# EAGLE design untitled (EAGLE 9.6.2)

## Sheet 1 of 5
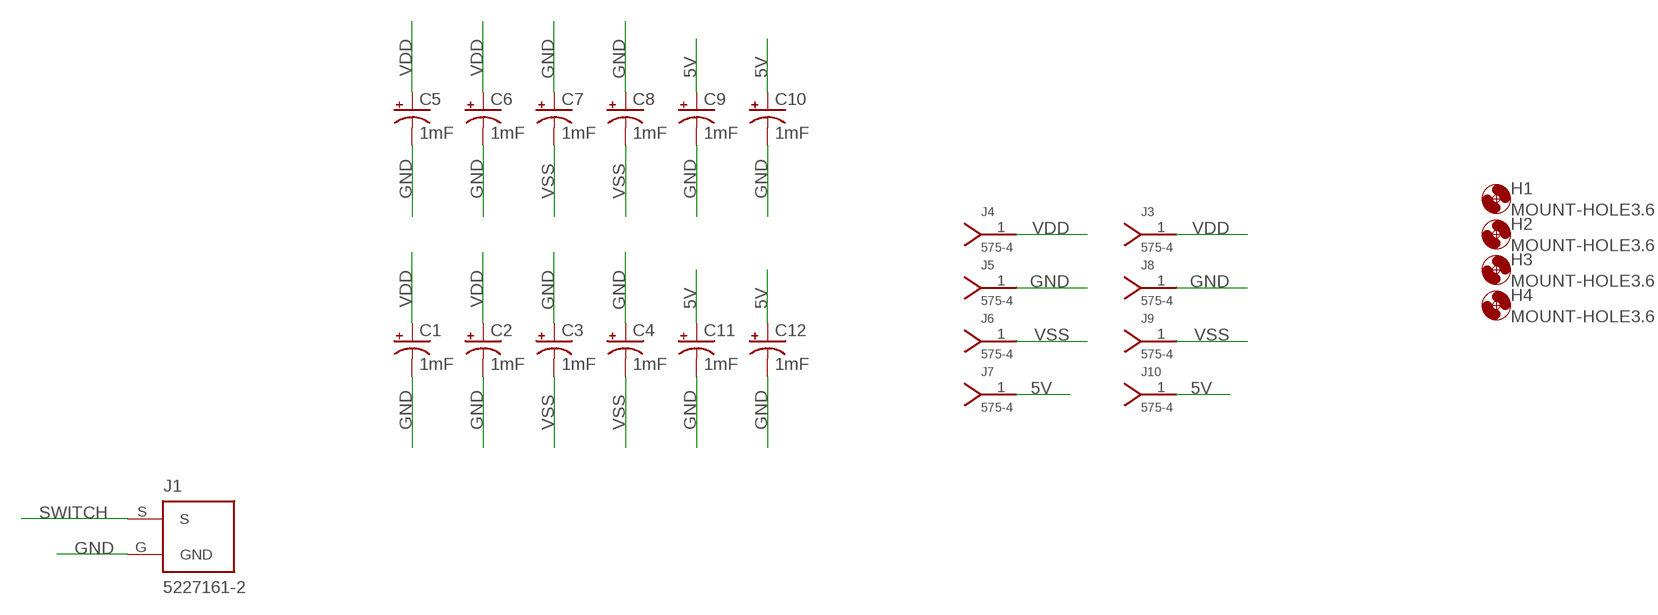
[diagram p0: schematic, sheet 1]

### Parts
C1  1mF  1000UF-RADIAL-5MM-25V-20%  [CPOL-RADIAL-5MM-10MM]
C2  1mF  1000UF-RADIAL-5MM-25V-20%  [CPOL-RADIAL-5MM-10MM]
C3  1mF  1000UF-RADIAL-5MM-25V-20%  [CPOL-RADIAL-5MM-10MM]
C4  1mF  1000UF-RADIAL-5MM-25V-20%  [CPOL-RADIAL-5MM-10MM]
C5  1mF  1000UF-RADIAL-5MM-25V-20%  [CPOL-RADIAL-5MM-10MM]
C6  1mF  1000UF-RADIAL-5MM-25V-20%  [CPOL-RADIAL-5MM-10MM]
C7  1mF  1000UF-RADIAL-5MM-25V-20%  [CPOL-RADIAL-5MM-10MM]
C8  1mF  1000UF-RADIAL-5MM-25V-20%  [CPOL-RADIAL-5MM-10MM]
C9  1mF  1000UF-RADIAL-5MM-25V-20%  [CPOL-RADIAL-5MM-10MM]
C10  1mF  1000UF-RADIAL-5MM-25V-20%  [CPOL-RADIAL-5MM-10MM]
C11  1mF  1000UF-RADIAL-5MM-25V-20%  [CPOL-RADIAL-5MM-10MM]
C12  1mF  1000UF-RADIAL-5MM-25V-20%  [CPOL-RADIAL-5MM-10MM]
H1  MOUNT-HOLE3.6  [3,6]
H2  MOUNT-HOLE3.6  [3,6]
H3  MOUNT-HOLE3.6  [3,6]
H4  MOUNT-HOLE3.6  [3,6]
J1  5227161-2  [TE_5227161-2]
J3  575-4  [KEYSTONE_575-4]
J4  575-4  [KEYSTONE_575-4]
J5  575-4  [KEYSTONE_575-4]
J6  575-4  [KEYSTONE_575-4]
J7  575-4  [KEYSTONE_575-4]
J8  575-4  [KEYSTONE_575-4]
J9  575-4  [KEYSTONE_575-4]
J10  575-4  [KEYSTONE_575-4]

### Nets
5V: C9.+ C10.+ C11.+ C12.+ J7.1 J10.1 ; also sheet 2,3,4,5
GND: C1.- C2.- C3.+ C4.+ C5.- C6.- C7.+ C8.+ C9.- C10.- C11.- C12.- J1.G(GND) J5.1 J8.1 ; also sheet 2,3,4,5
SWITCH: J1.S ; also sheet 2,3,4,5
VDD: C1.+ C2.+ C5.+ C6.+ J3.1 J4.1 ; also sheet 2,3,4,5
VSS: C3.- C4.- C7.- C8.- J6.1 J9.1 ; also sheet 2,3,4,5

## Sheet 2 of 5
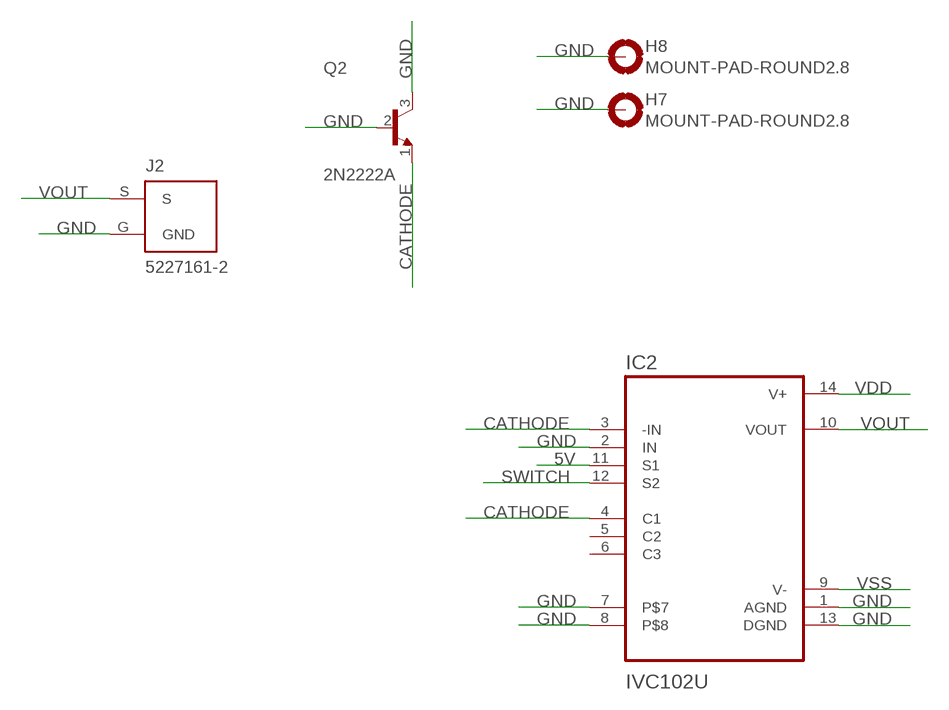
[diagram p1: schematic, sheet 2]

### Parts
H7  MOUNT-PAD-ROUND2.8  [2,8-PAD]
H8  MOUNT-PAD-ROUND2.8  [2,8-PAD]
IC2  IVC102U  [SOIC127P600X175-14N]
J2  5227161-2  [TE_5227161-2]
Q2  2N2222A  [TO127P584H533-3]

### Nets
5V: IC2.11(S1) ; also sheet 1,3,4,5
CATHODE: IC2.3(-IN) IC2.4(C1) Q2.1(E)
GND: H7.B2,8(MOUNT) H8.B2,8(MOUNT) IC2.1(AGND) IC2.2(IN) IC2.7 IC2.8 IC2.13(DGND) J2.G(GND) Q2.2(B) Q2.3(C) ; also sheet 1,3,4,5
SWITCH: IC2.12(S2) ; also sheet 1,3,4,5
VDD: IC2.14(V+) ; also sheet 1,3,4,5
VOUT: IC2.10(VOUT) J2.S
VSS: IC2.9(V-) ; also sheet 1,3,4,5
Unconnected: IC2.5(C2) IC2.6(C3)

## Sheet 3 of 5
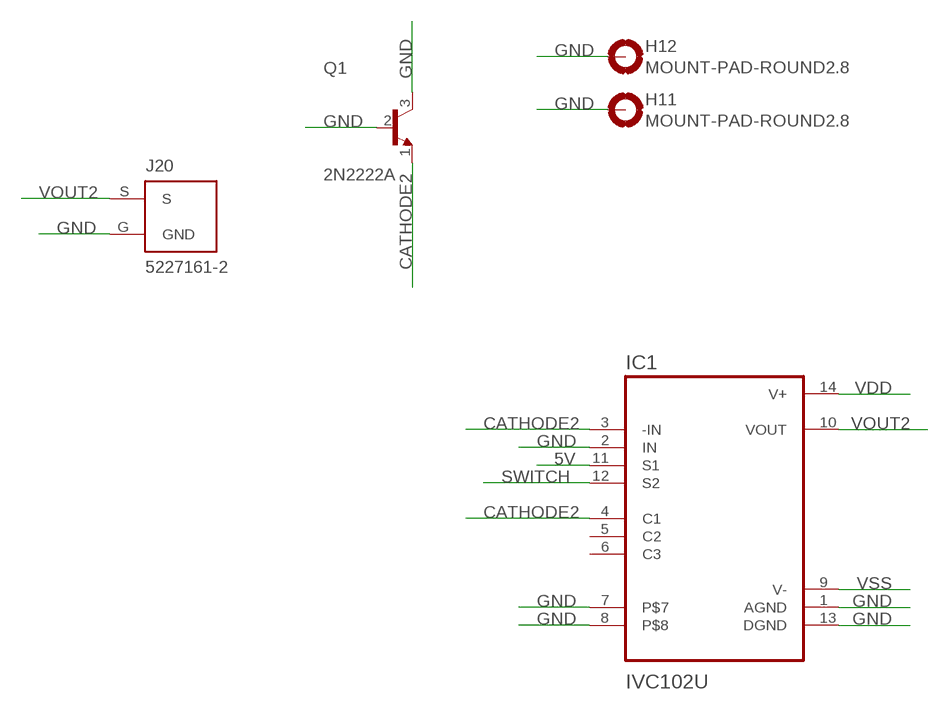
[diagram p2: schematic, sheet 3]

### Parts
H11  MOUNT-PAD-ROUND2.8  [2,8-PAD]
H12  MOUNT-PAD-ROUND2.8  [2,8-PAD]
IC1  IVC102U  [SOIC127P600X175-14N]
J20  5227161-2  [TE_5227161-2]
Q1  2N2222A  [TO127P584H533-3]

### Nets
5V: IC1.11(S1) ; also sheet 1,2,4,5
CATHODE2: IC1.3(-IN) IC1.4(C1) Q1.1(E)
GND: H11.B2,8(MOUNT) H12.B2,8(MOUNT) IC1.1(AGND) IC1.2(IN) IC1.7 IC1.8 IC1.13(DGND) J20.G(GND) Q1.2(B) Q1.3(C) ; also sheet 1,2,4,5
SWITCH: IC1.12(S2) ; also sheet 1,2,4,5
VDD: IC1.14(V+) ; also sheet 1,2,4,5
VOUT2: IC1.10(VOUT) J20.S
VSS: IC1.9(V-) ; also sheet 1,2,4,5
Unconnected: IC1.5(C2) IC1.6(C3)

## Sheet 4 of 5
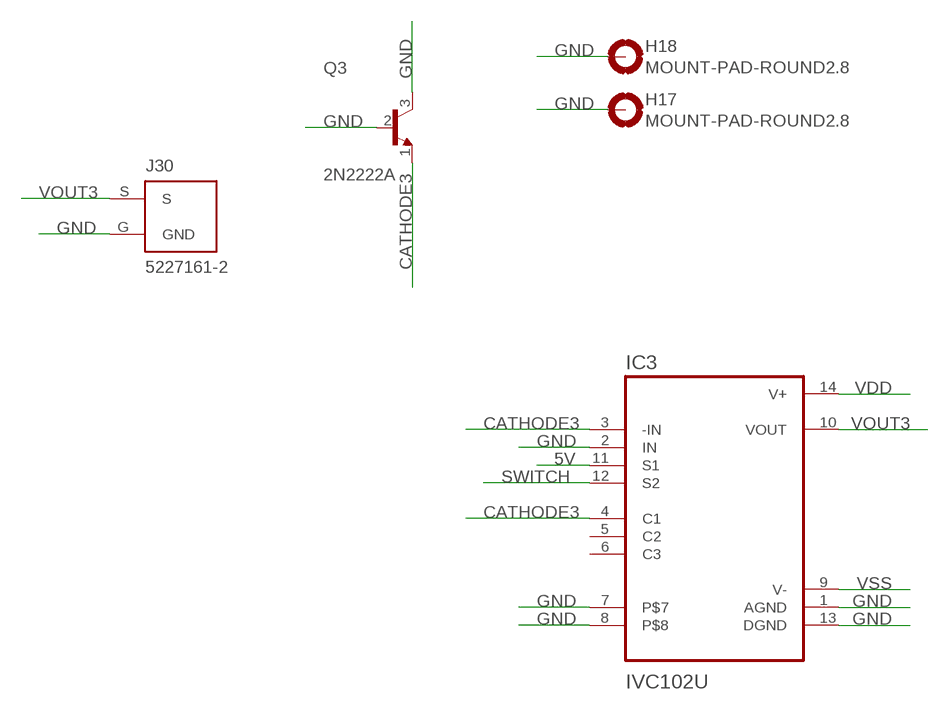
[diagram p3: schematic, sheet 4]

### Parts
H17  MOUNT-PAD-ROUND2.8  [2,8-PAD]
H18  MOUNT-PAD-ROUND2.8  [2,8-PAD]
IC3  IVC102U  [SOIC127P600X175-14N]
J30  5227161-2  [TE_5227161-2]
Q3  2N2222A  [TO127P584H533-3]

### Nets
5V: IC3.11(S1) ; also sheet 1,2,3,5
CATHODE3: IC3.3(-IN) IC3.4(C1) Q3.1(E)
GND: H17.B2,8(MOUNT) H18.B2,8(MOUNT) IC3.1(AGND) IC3.2(IN) IC3.7 IC3.8 IC3.13(DGND) J30.G(GND) Q3.2(B) Q3.3(C) ; also sheet 1,2,3,5
SWITCH: IC3.12(S2) ; also sheet 1,2,3,5
VDD: IC3.14(V+) ; also sheet 1,2,3,5
VOUT3: IC3.10(VOUT) J30.S
VSS: IC3.9(V-) ; also sheet 1,2,3,5
Unconnected: IC3.5(C2) IC3.6(C3)

## Sheet 5 of 5
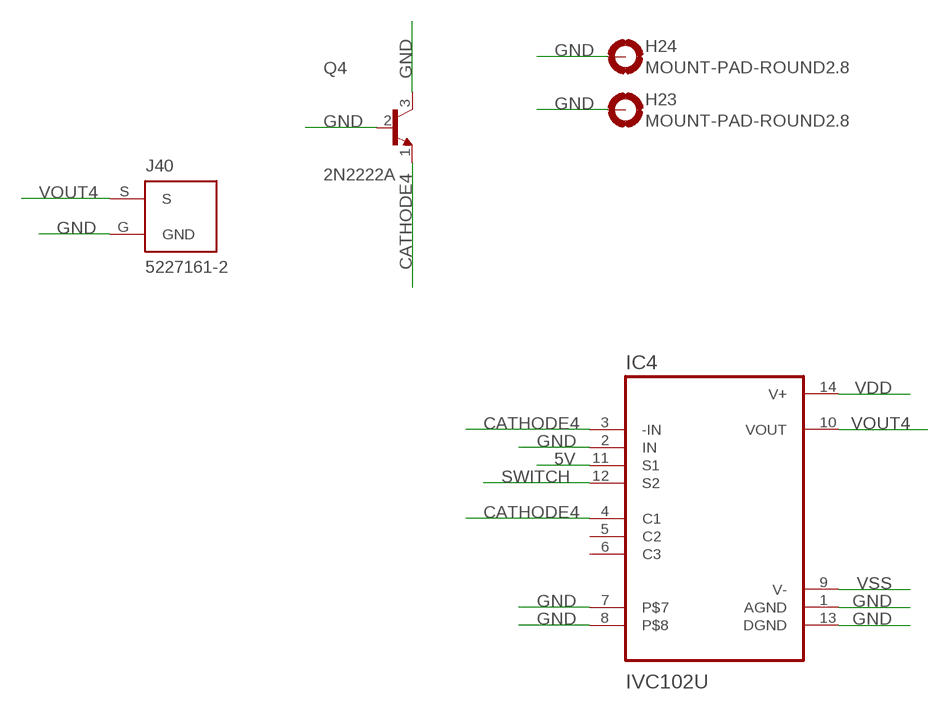
[diagram p4: schematic, sheet 5]

### Parts
H23  MOUNT-PAD-ROUND2.8  [2,8-PAD]
H24  MOUNT-PAD-ROUND2.8  [2,8-PAD]
IC4  IVC102U  [SOIC127P600X175-14N]
J40  5227161-2  [TE_5227161-2]
Q4  2N2222A  [TO127P584H533-3]

### Nets
5V: IC4.11(S1) ; also sheet 1,2,3,4
CATHODE4: IC4.3(-IN) IC4.4(C1) Q4.1(E)
GND: H23.B2,8(MOUNT) H24.B2,8(MOUNT) IC4.1(AGND) IC4.2(IN) IC4.7 IC4.8 IC4.13(DGND) J40.G(GND) Q4.2(B) Q4.3(C) ; also sheet 1,2,3,4
SWITCH: IC4.12(S2) ; also sheet 1,2,3,4
VDD: IC4.14(V+) ; also sheet 1,2,3,4
VOUT4: IC4.10(VOUT) J40.S
VSS: IC4.9(V-) ; also sheet 1,2,3,4
Unconnected: IC4.5(C2) IC4.6(C3)

## Library data of the parts
C1-C12 = SparkFun-Capacitors:1000UF: 1,000µF/1mF ceramic capacitors A capacitor is a passive two-terminal electrical component used to store electrical energy temporarily in an electric field. CAP-08070; PROD_ID: CAP-09538
H1-H4 = holes:MOUNT-HOLE: MOUNTING HOLE with drill center marker
H7 H8 H11 H12 H17 H18 H23 H24 = holes:MOUNT-PAD-ROUND: MOUNTING PAD, round
IC1-IC4 = IVC102U:IVC102U: Check prices <https://pricing.snapeda.com/parts/IVC102U/Texas/view-part?ref=eda>; AVAILABILITY: Good; DESCRIPTION: Precision Switched Integrator Transimpedance Amplifier 14-SOIC -40 to 125; MF: Texas; MP: IVC102U; PACKAGE: SO-14 Burr Brown; PRICE: None; PURCHASE-URL: https://pricing.snapeda.com/search/part/IVC102U/?ref=eda
J1 J2 J20 J30 J40 = 5227161-2:5227161-2: Jack, PCB; 50 Ohms; Right Angle; BNC; Gold (30); Panel; Jack; Valox; Phosphor Bronze; COMMENT: 5227161-2; DESCRIPTION: Valox Black 50 Ohm Right Angle Jack PCB Mount BNC Connector; DIGI-KEY_PART_NUMBER: A32245-ND; EU_ROHS_COMPLIANCE: Compliant with Exemptions; MF: TE Connectivity; MP: 5227161-2; NUMBER_OF_POSITIONS: 1; PACKAGE: SMD-6 Omron Electronics; PURCHASE-URL: https://pricing.snapeda.com/search/part/5227161-2/?ref=eda
J3-J10 = 575-4:575-4: Battery Holders, Contacts and Clips JACK; DESCRIPTION: Banana Jack- Non-Insulated .218 Length; DIGI-KEY_PART_NUMBER: 36-575-4-ND; MF: Keystone Electronics; MP: 575-4; PACKAGE: None; PURCHASE-URL: https://pricing.snapeda.com/search/part/575-4/?ref=eda
Q1-Q4 = 2N2222A:2N2222A: 2N2222A 50 V 800 mA NPN Silicon Switching Transistor - TO-18 (TO-206AA) Check prices <https://pricing.snapeda.com/parts/2N2222A/ON%20Semiconductor/view-part?ref=eda>; AVAILABILITY: Good; DESCRIPTION: Bipolar (BJT) Transistor NPN 50V 800mA 500mW Through Hole TO-18; MF: ON Semiconductor; MP: 2N2222A; PACKAGE: TO-18 Microsemi; PRICE: None; PURCHASE-URL: https://pricing.snapeda.com/search/part/2N2222A/?ref=eda

## Board
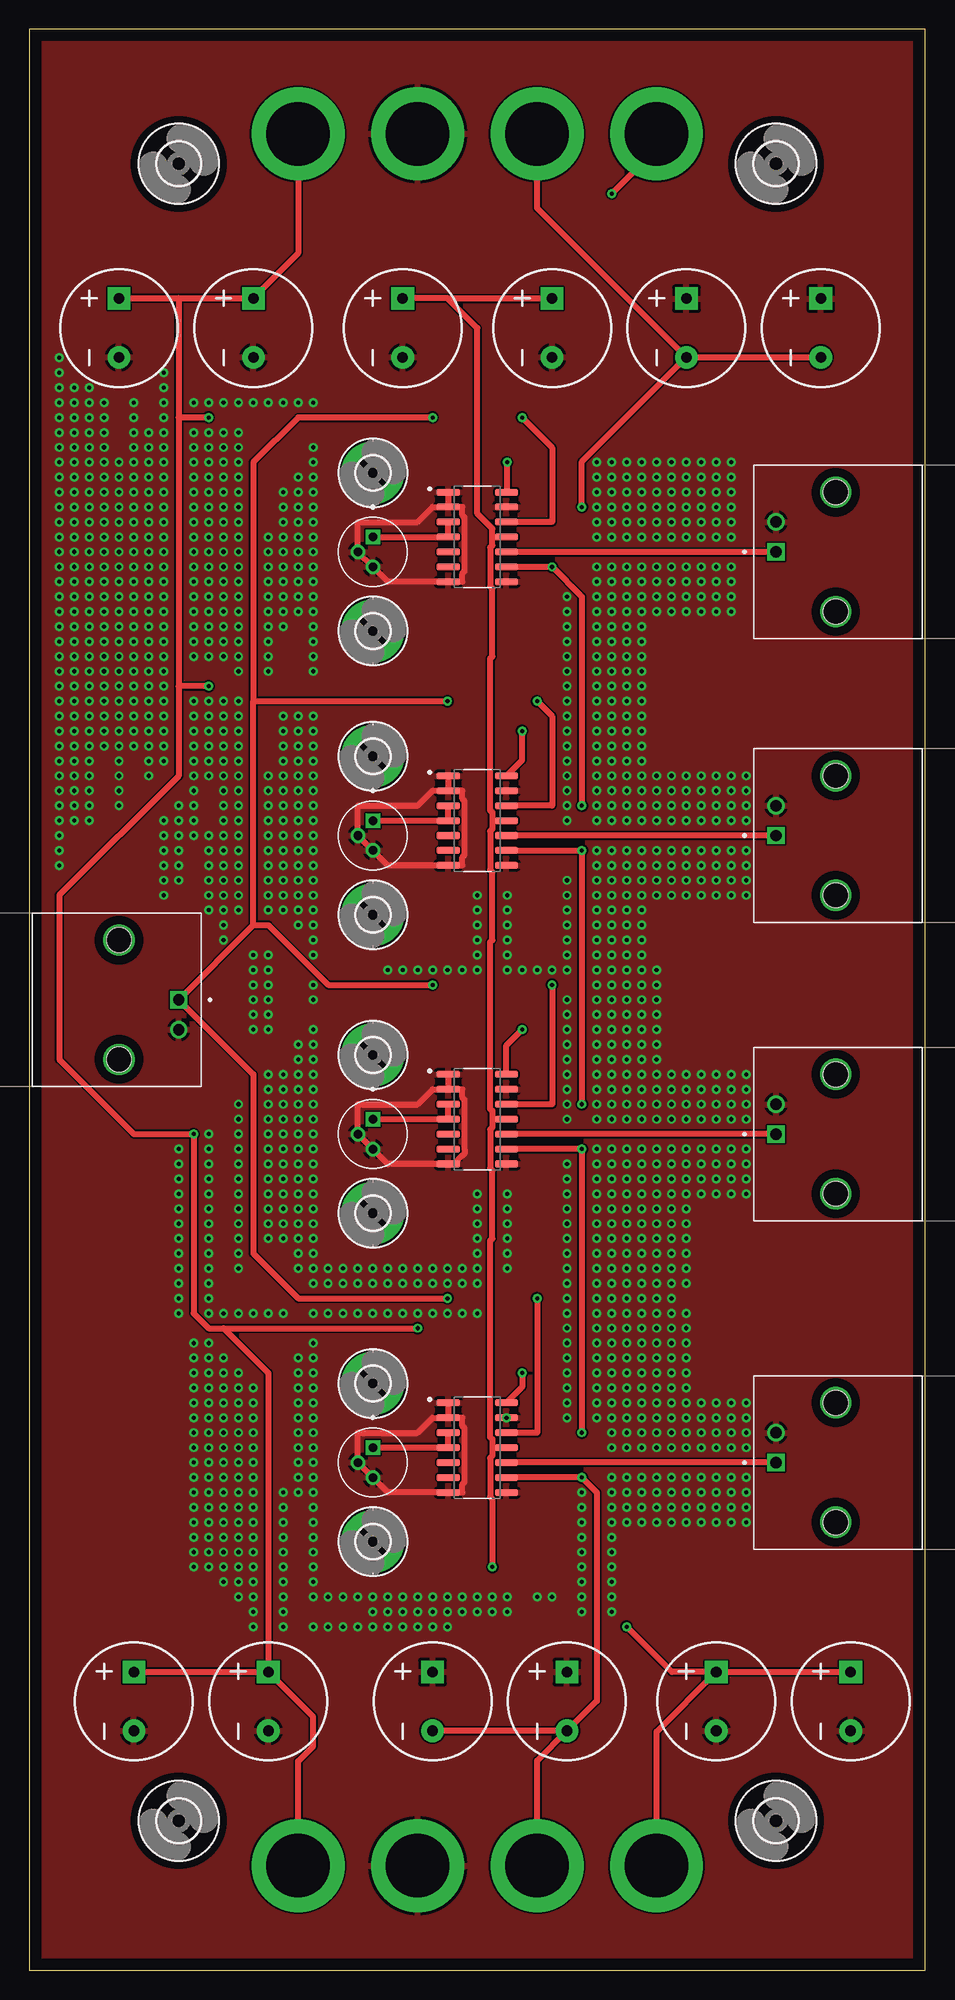
[diagram p5: board, top side]
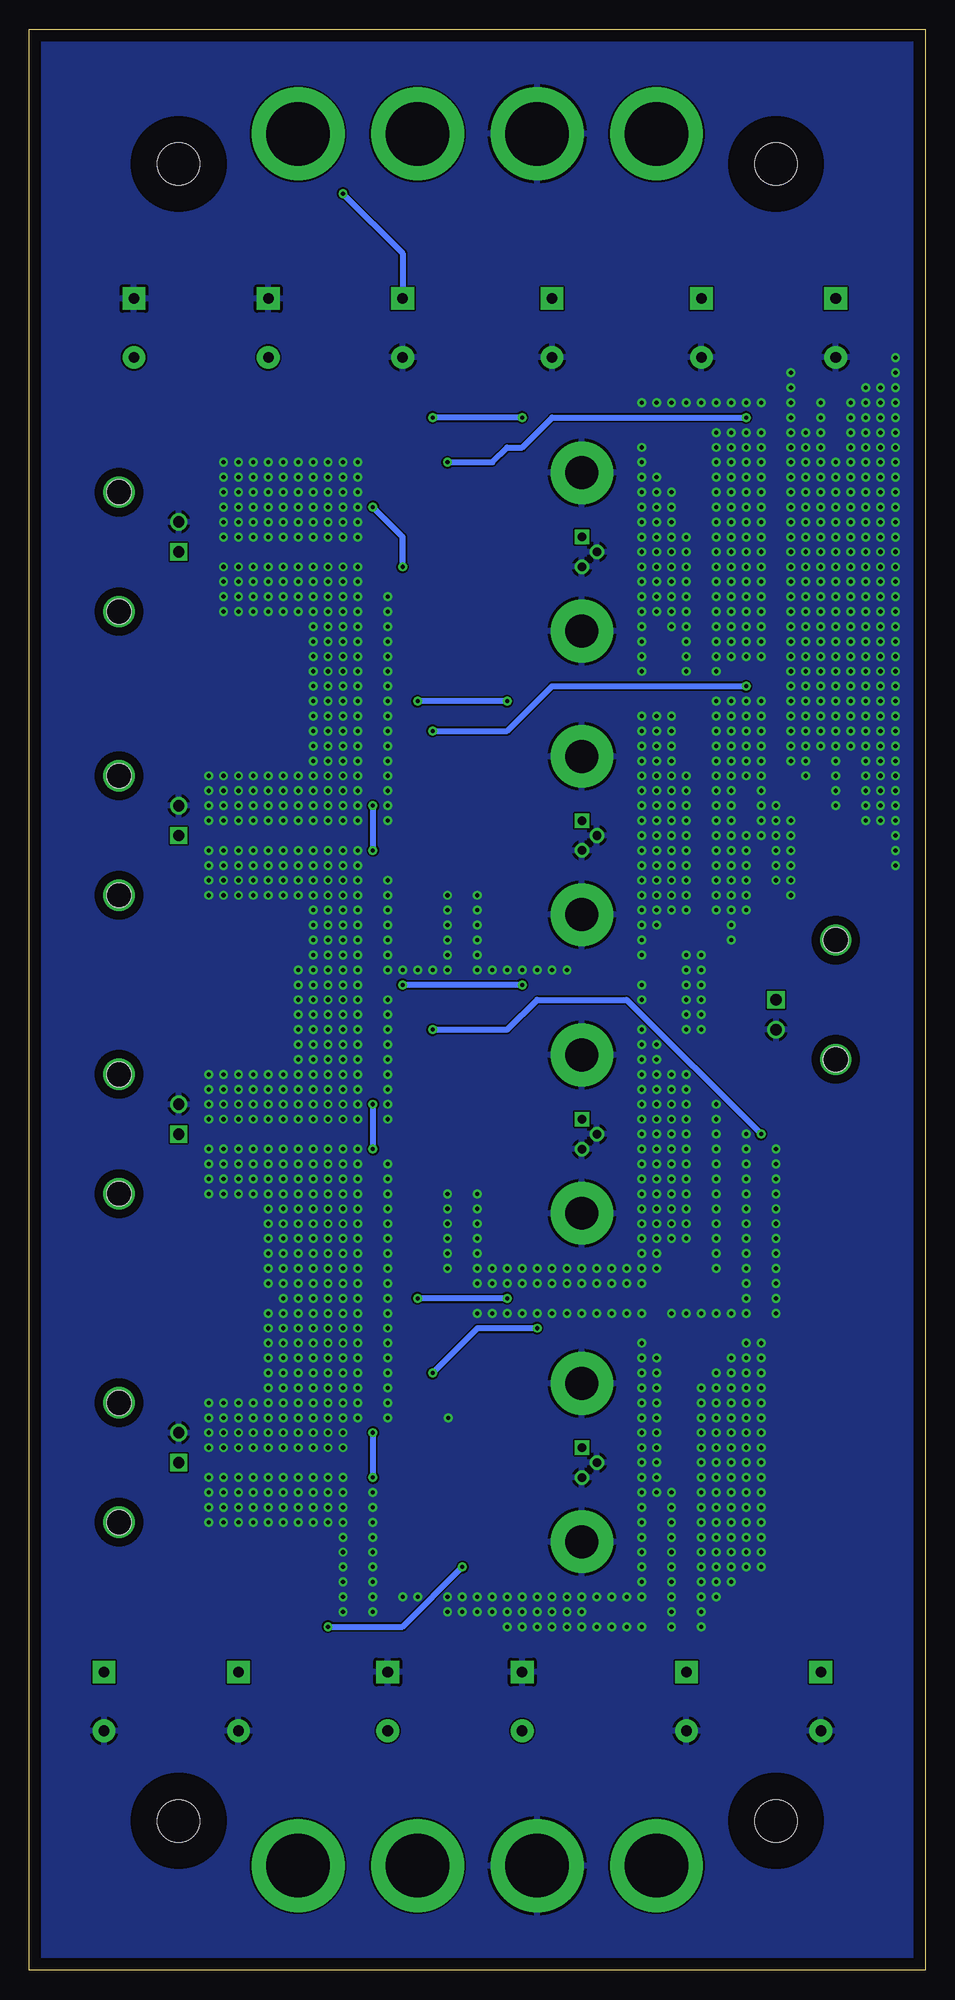
[diagram p6: board, bottom side, seen from below]

Size 76.2 x 165.1 mm. Coordinates in mm from the lower left corner, seen from the top.
Outline: 0,0 76.2,0 76.2,165.1 0,165.1 0,0
Copper layers (1*16): Top 0.035mm / dielectric 1.5mm / Bottom 0.035mm
Design rules "default": minimum track width 6mil, minimum drill 0.35mm, track to track 6mil, track to pad 6mil, pad to pad 6mil, via to via 6mil, smd to smd 6mil, copper to edge 40mil, drill to drill 6mil, minimum pad ring 10mil, minimum via ring 8mil, stop-mask expansion 4mil, vias tented up to drill 0mil, thermal gap 10mil

### Footprints (pad centres in the part's own frame; a part is rotated, then mirrored left to right if it is on the bottom)
CPOL-RADIAL-5MM-10MM = drill 0.9 pad 1.93 square: + 2.5,0 | drill 0.9 pad 1.93: - -2.5,0
3,6 = hole 3.6: 0,0
2,8-PAD = drill 2.8 pad 5.334: B2,8 0,0
SOIC127P600X175-14N = smd 1.97 x 0.6: 1 -2.475,3.81; 2 -2.475,2.54; 3 -2.475,1.27; 4 -2.475,0; 5 -2.475,-1.27; 6 -2.475,-2.54; 7 -2.475,-3.81; 8 2.475,-3.81; 9 2.475,-2.54; 10 2.475,-1.27; 11 2.475,0; 12 2.475,1.27; 13 2.475,2.54; 14 2.475,3.81
TE_5227161-2 = drill 0.97: G -2.54,-5.08 | drill 0.97 square: S 0,-5.08 | hole 2.09: 5.08,0; -5.08,0
KEYSTONE_575-4 = drill 5.4 pad 7.9: 1 0,0
TO127P584H533-3 = drill 0.73 pad 1.13 square: 1 -1.27,0 | drill 0.73 pad 1.13: 2 0,-1.27; 3 1.27,0

### Placement (x,y rotation side)
C1  8.89,22.86 90 top
C2  20.32,22.86 90 top
C3  34.29,22.86 90 top
C4  45.72,22.86 90 top
C5  7.62,139.7 90 top
C6  19.05,139.7 90 top
C7  67.31,139.7 90 top
C8  55.88,139.7 90 top
C9  31.75,139.7 90 top
C10  44.45,139.7 90 top
C11  58.42,22.86 90 top
C12  69.85,22.86 90 top
H1  63.5,153.67 0 top
H2  12.7,153.67 0 top
H3  63.5,12.7 0 top
H4  12.7,12.7 0 top
H7  29.21,127.38 0 top
H8  29.21,113.92 0 top
H11  29.21,103.25 0 top
H12  29.21,89.79 0 top
H17  29.21,77.85 0 top
H18  29.21,64.39 0 top
H23  29.21,49.91 0 top
H24  29.21,36.45 0 top
IC1  38.1,97.79 0 top
IC2  38.1,121.92 0 top
IC3  38.1,72.39 0 top
IC4  38.1,44.45 0 top
J1  7.62,82.55 90 top
J2  68.58,120.65 270 top
J3  22.86,8.89 0 top
J4  22.86,156.21 180 top
J5  33.02,156.21 180 top
J6  43.18,156.21 180 top
J7  53.34,156.21 180 top
J8  33.02,8.89 0 top
J9  43.18,8.89 0 top
J10  53.34,8.89 0 top
J20  68.58,96.52 270 top
J30  68.58,71.12 270 top
J40  68.58,43.18 270 top
Q1  29.21,96.52 270 top
Q2  29.21,120.65 270 top
Q3  29.21,71.12 270 top
Q4  29.21,43.18 270 top

### Tracks (layer width: path | path; a pad name or v marks a point on that pad's centre or on a via)
5V  (via drill 0.35)
  Top 0.508: 39.37,121.92 39.37,121.22 39.18,121.03 39.18,117.73 39.37,117.54 39.37,111.76 39.18,111.57 39.18,98.68 39.37,98.49 39.37,97.79 | 39.37,121.92 39.37,122.62 38.1,123.89 38.1,139.7 35.6,142.2 | 39.37,97.79 39.37,97.09 39.18,96.9 39.18,93.6 39.37,93.41 39.37,87.63 39.18,87.44 39.18,73.28 39.37,73.09 39.37,72.39 | 39.37,72.39 39.37,71.69 39.18,71.5 39.18,68.2 39.37,68.01 39.37,62.23 39.18,62.04 39.18,45.34 39.37,45.15 39.37,44.45 | v39.37,34.29 39.37,40.07 39.18,40.26 39.18,43.56 39.37,43.75 39.37,44.45 | J7.1 53.34,154.94 v49.53,151.13 | C10.+ 35.6,142.2 | 35.6,142.2 35.56,142.24 31.79,142.24 C9.+ | J10.1 53.34,20.28 C11.+ | C11.+ C12.+ | C11.+ 54.65,25.36 v50.8,29.21 | 39.37,97.79 IC1.11 | 39.37,121.92 IC2.11 | 39.37,72.39 IC3.11 | 39.37,44.45 IC4.11
  Bottom 0.508: v49.53,151.13 44.45,146.05 C10.+ | v50.8,29.21 44.45,29.21 v39.37,34.29
CATHODE
  Top 0.508: Q2.1 IC2.4 IC2.3
CATHODE2
  Top 0.508: Q1.1 IC1.4 IC1.3
CATHODE3
  Top 0.508: Q3.1 IC3.4 IC3.3
CATHODE4
  Top 0.508: Q4.1 IC4.4 IC4.3
GND  (via drill 0.35)
  Top 0.508: IC2.2 34.29,124.46 33.02,123.19 27.94,123.19 Q2.2 Q2.3 30.48,118.11 IC2.7 36.83,118.11 36.83,118.81 37.02,119 37.02,123.57 36.83,123.76 36.83,124.46 IC2.2 | IC2.1 IC2.2 | IC1.2 34.29,100.33 33.02,99.06 27.94,99.06 Q1.2 Q1.3 30.48,93.98 IC1.7 36.83,93.98 36.83,94.68 37.02,94.87 37.02,99.44 36.83,99.63 36.83,100.33 IC1.2 | IC1.1 IC1.2 | IC3.2 34.29,74.93 33.02,73.66 27.94,73.66 Q3.2 Q3.3 30.48,68.58 35.56,68.58 IC3.7 36.13,68.58 36.83,69.28 37.02,69.47 37.02,69.85 37.02,74.04 36.83,74.23 36.83,74.93 IC3.2 | IC3.1 IC3.2 | IC4.2 34.29,46.99 33.02,45.72 27.94,45.72 Q4.2 Q4.3 30.48,40.64 IC4.7 36.83,40.64 36.83,41.34 37.02,41.53 37.02,46.1 36.83,46.29 36.83,46.99 IC4.2 | IC4.1 IC4.2
  other vias: 40.58,46.99 24.13,31.75 25.4,31.75 24.13,33.02 24.13,34.29 24.13,35.56 24.13,36.83 24.13,38.1 24.13,39.37 24.13,40.64 24.13,41.91 24.13,43.18 24.13,44.45 24.13,45.72 24.13,46.99 24.13,48.26 24.13,49.53 24.13,50.8 24.13,52.07 24.13,53.34 24.13,55.88 24.13,58.42 24.13,59.69 24.13,60.96 24.13,62.23 24.13,63.5 24.13,64.77 24.13,66.04 24.13,67.31 24.13,68.58 24.13,69.85 24.13,71.12 24.13,72.39 24.13,73.66 24.13,74.93 24.13,76.2 24.13,77.47 24.13,78.74 24.13,80.01 24.13,82.55 24.13,83.82 24.13,86.36 24.13,87.63 24.13,88.9 24.13,90.17 24.13,91.44 24.13,92.71 24.13,93.98 24.13,95.25 24.13,96.52 24.13,97.79 24.13,99.06 24.13,100.33 24.13,101.6 24.13,102.87 24.13,104.14 24.13,105.41 24.13,106.68 24.13,110.49 24.13,111.76 24.13,113.03 24.13,114.3 24.13,115.57 24.13,116.84 24.13,118.11 24.13,119.38 24.13,120.65 24.13,121.92 24.13,123.19 24.13,124.46 24.13,125.73 24.13,127 24.13,128.27 24.13,129.54 26.67,31.75 27.94,31.75 29.21,31.75 30.48,31.75 31.75,31.75 33.02,31.75 34.29,31.75 35.56,31.75 36.83,31.75 38.1,31.75 39.37,31.75 40.64,31.75 43.18,31.75 44.45,31.75 48.26,119.38 49.53,119.38 50.8,119.38 52.07,119.38 53.34,119.38 54.61,119.38 55.88,119.38 57.15,119.38 58.42,119.38 59.69,119.38 48.26,121.92 49.53,121.92 50.8,121.92 52.07,121.92 53.34,121.92 54.61,121.92 55.88,121.92 57.15,121.92 58.42,121.92 59.69,121.92 15.24,111.76 15.24,113.03 15.24,114.3 15.24,115.57 15.24,116.84 15.24,118.11 16.51,111.76 16.51,113.03 16.51,114.3 16.51,115.57 16.51,116.84 16.51,118.11 17.78,110.49 17.78,111.76 17.78,113.03 17.78,114.3 17.78,115.57 17.78,116.84 17.78,118.11 17.78,119.38 17.78,120.65 17.78,121.92 15.24,119.38 15.24,120.65 15.24,121.92 15.24,123.19 15.24,124.46 15.24,125.73 15.24,127 15.24,128.27 15.24,129.54 15.24,130.81 16.51,119.38 16.51,120.65 16.51,121.92 16.51,123.19 16.51,124.46 16.51,125.73 16.51,127 16.51,128.27 16.51,129.54 16.51,130.81 17.78,130.81 17.78,129.54 17.78,128.27 17.78,127 17.78,125.73 17.78,124.46 17.78,123.19 20.32,110.49 20.32,111.76 20.32,113.03 20.32,114.3 20.32,115.57 20.32,116.84 20.32,118.11 20.32,119.38 20.32,120.65 20.32,121.92 21.59,114.3 21.59,115.57 21.59,116.84 21.59,118.11 21.59,119.38 21.59,120.65 21.59,121.92 21.59,123.19 21.59,124.46 21.59,125.73 22.86,115.57 22.86,116.84 22.86,118.11 22.86,119.38 22.86,120.65 22.86,121.92 22.86,123.19 22.86,124.46 22.86,125.73 22.86,127 13.97,111.76 13.97,113.03 13.97,114.3 13.97,115.57 13.97,116.84 13.97,118.11 11.43,102.87 11.43,104.14 11.43,105.41 11.43,106.68 11.43,107.95 11.43,109.22 11.43,110.49 11.43,111.76 11.43,113.03 11.43,114.3 10.16,109.22 10.16,110.49 10.16,111.76 10.16,113.03 10.16,114.3 10.16,115.57 10.16,101.6 10.16,102.87 10.16,104.14 10.16,105.41 10.16,106.68 10.16,107.95 8.89,104.14 8.89,105.41 8.89,106.68 8.89,107.95 8.89,109.22 8.89,110.49 7.62,106.68 7.62,107.95 7.62,109.22 7.62,110.49 7.62,111.76 7.62,113.03 8.89,111.76 8.89,113.03 8.89,114.3 8.89,115.57 8.89,116.84 8.89,118.11 7.62,114.3 7.62,115.57 7.62,116.84 7.62,118.11 7.62,119.38 7.62,120.65 11.43,115.57 11.43,116.84 11.43,118.11 11.43,119.38 11.43,120.65 11.43,121.92 11.43,123.19 11.43,124.46 11.43,125.73 11.43,127 13.97,119.38 13.97,120.65 13.97,121.92 13.97,123.19 13.97,124.46 13.97,125.73 13.97,127 13.97,128.27 13.97,129.54 13.97,130.81 10.16,116.84 10.16,118.11 10.16,119.38 10.16,120.65 10.16,121.92 10.16,123.19 11.43,128.27 11.43,129.54 11.43,130.81 11.43,132.08 11.43,133.35 11.43,134.62 11.43,135.89 10.16,124.46 10.16,125.73 10.16,127 10.16,128.27 10.16,129.54 10.16,130.81 8.89,119.38 8.89,120.65 8.89,121.92 8.89,123.19 8.89,124.46 8.89,125.73 8.89,127 8.89,128.27 8.89,129.54 8.89,130.81 8.89,132.08 8.89,133.35 7.62,121.92 7.62,123.19 7.62,124.46 7.62,125.73 7.62,127 7.62,128.27 6.35,119.38 6.35,120.65 6.35,121.92 6.35,123.19 6.35,124.46 6.35,125.73 6.35,127 6.35,128.27 6.35,129.54 6.35,130.81 6.35,132.08 6.35,133.35 5.08,120.65 5.08,121.92 5.08,123.19 5.08,124.46 5.08,125.73 5.08,127 5.08,128.27 5.08,129.54 5.08,130.81 5.08,132.08 5.08,133.35 5.08,134.62 3.81,128.27 3.81,129.54 3.81,130.81 3.81,132.08 3.81,133.35 3.81,134.62 2.54,124.46 2.54,125.73 2.54,127 2.54,128.27 2.54,129.54 2.54,130.81 2.54,132.08 2.54,133.35 2.54,134.62 2.54,135.89 2.54,137.16 3.81,120.65 3.81,121.92 3.81,123.19 3.81,124.46 3.81,125.73 3.81,127 5.08,113.03 5.08,114.3 5.08,115.57 5.08,116.84 5.08,118.11 5.08,119.38 5.08,105.41 5.08,106.68 5.08,107.95 5.08,109.22 5.08,110.49 5.08,111.76 6.35,111.76 6.35,113.03 6.35,114.3 6.35,115.57 6.35,116.84 6.35,118.11 6.35,104.14 6.35,105.41 6.35,106.68 6.35,107.95 6.35,109.22 6.35,110.49 2.54,116.84 2.54,118.11 2.54,119.38 2.54,120.65 2.54,121.92 2.54,123.19 3.81,113.03 3.81,114.3 3.81,115.57 3.81,116.84 3.81,118.11 3.81,119.38 2.54,109.22 2.54,110.49 2.54,111.76 2.54,113.03 2.54,114.3 2.54,115.57 3.81,105.41 3.81,106.68 3.81,107.95 3.81,109.22 3.81,110.49 3.81,111.76 2.54,101.6 2.54,102.87 2.54,104.14 2.54,105.41 2.54,106.68 2.54,107.95 2.54,93.98 2.54,95.25 2.54,96.52 2.54,97.79 2.54,99.06 2.54,100.33 3.81,97.79 3.81,99.06 3.81,100.33 3.81,101.6 3.81,102.87 3.81,104.14 5.08,97.79 5.08,99.06 5.08,100.33 5.08,101.6 5.08,102.87 5.08,104.14 7.62,99.06 7.62,100.33 7.62,101.6 7.62,102.87 7.62,104.14 7.62,105.41 11.43,91.44 11.43,92.71 11.43,93.98 11.43,95.25 11.43,96.52 11.43,97.79 12.7,92.71 12.7,93.98 12.7,95.25 12.7,96.52 12.7,97.79 12.7,99.06 13.97,96.52 13.97,97.79 13.97,99.06 13.97,100.33 13.97,101.6 13.97,102.87 13.97,104.14 13.97,105.41 13.97,106.68 13.97,107.95 15.24,101.6 15.24,102.87 15.24,104.14 15.24,105.41 15.24,106.68 15.24,107.95 16.51,102.87 16.51,104.14 16.51,105.41 16.51,106.68 16.51,107.95 17.78,102.87 17.78,104.14 17.78,105.41 17.78,106.68 17.78,107.95 16.51,95.25 16.51,96.52 16.51,97.79 16.51,99.06 16.51,100.33 16.51,101.6 15.24,90.17 15.24,91.44 15.24,92.71 15.24,93.98 15.24,95.25 15.24,96.52 16.51,87.63 16.51,88.9 16.51,90.17 16.51,91.44 16.51,92.71 16.51,93.98 17.78,90.17 17.78,91.44 17.78,92.71 17.78,93.98 17.78,95.25 17.78,96.52 17.78,97.79 17.78,99.06 17.78,100.33 17.78,101.6 20.32,90.17 20.32,91.44 20.32,92.71 20.32,93.98 20.32,95.25 20.32,96.52 20.32,97.79 20.32,99.06 20.32,100.33 20.32,101.6 21.59,95.25 21.59,96.52 21.59,97.79 21.59,99.06 21.59,100.33 21.59,101.6 21.59,102.87 21.59,104.14 21.59,105.41 21.59,106.68 21.59,90.17 21.59,91.44 21.59,92.71 21.59,93.98 22.86,95.25 22.86,96.52 22.86,97.79 22.86,99.06 22.86,100.33 22.86,101.6 22.86,102.87 22.86,104.14 22.86,105.41 22.86,106.68 22.86,88.9 22.86,90.17 22.86,91.44 22.86,92.71 22.86,93.98 13.97,133.35 15.24,133.35 16.51,133.35 17.78,133.35 19.05,133.35 20.32,133.35 21.59,133.35 22.86,133.35 24.13,133.35 20.32,80.01 20.32,81.28 20.32,82.55 20.32,83.82 20.32,85.09 20.32,86.36 19.05,80.01 19.05,81.28 19.05,82.55 19.05,83.82 19.05,85.09 19.05,86.36 22.86,74.93 22.86,76.2 22.86,77.47 22.86,78.74 21.59,69.85 21.59,71.12 21.59,72.39 21.59,73.66 21.59,74.93 21.59,76.2 20.32,69.85 20.32,71.12 20.32,72.39 20.32,73.66 20.32,74.93 20.32,76.2 22.86,67.31 22.86,68.58 22.86,69.85 22.86,71.12 22.86,72.39 22.86,73.66 21.59,62.23 21.59,63.5 21.59,64.77 21.59,66.04 21.59,67.31 21.59,68.58 20.32,62.23 20.32,63.5 20.32,64.77 20.32,66.04 20.32,67.31 20.32,68.58 22.86,59.69 22.86,60.96 22.86,62.23 22.86,63.5 22.86,64.77 22.86,66.04 17.78,59.69 17.78,60.96 17.78,62.23 17.78,63.5 17.78,64.77 17.78,66.04 17.78,67.31 17.78,68.58 17.78,69.85 17.78,71.12 17.78,72.39 17.78,73.66 15.24,64.77 15.24,66.04 15.24,67.31 15.24,68.58 15.24,69.85 15.24,71.12 15.24,57.15 15.24,58.42 15.24,59.69 15.24,60.96 15.24,62.23 15.24,63.5 12.7,63.5 12.7,64.77 12.7,66.04 12.7,67.31 12.7,68.58 12.7,69.85 12.7,55.88 12.7,57.15 12.7,58.42 12.7,59.69 12.7,60.96 12.7,62.23 21.59,55.88 20.32,55.88 19.05,55.88 17.78,55.88 16.51,55.88 15.24,55.88 31.75,55.88 30.48,55.88 29.21,55.88 27.94,55.88 26.67,55.88 25.4,55.88 31.75,58.42 30.48,58.42 29.21,58.42 27.94,58.42 26.67,58.42 25.4,58.42 31.75,59.69 30.48,59.69 29.21,59.69 27.94,59.69 26.67,59.69 25.4,59.69 38.1,59.69 36.83,59.69 35.56,59.69 34.29,59.69 33.02,59.69 38.1,58.42 36.83,58.42 35.56,58.42 34.29,58.42 33.02,58.42 38.1,55.88 36.83,55.88 35.56,55.88 34.29,55.88 33.02,55.88 38.1,60.96 38.1,62.23 38.1,63.5 38.1,64.77 38.1,66.04 40.64,59.69 40.64,60.96 40.64,62.23 40.64,63.5 40.64,64.77 40.64,66.04 45.72,54.61 45.72,55.88 45.72,57.15 45.72,58.42 45.72,59.69 45.72,60.96 45.72,62.23 45.72,63.5 45.72,64.77 45.72,66.04 45.72,67.31 45.72,68.58 48.26,62.23 48.26,63.5 48.26,64.77 48.26,66.04 48.26,67.31 48.26,68.58 45.72,46.99 45.72,48.26 45.72,49.53 45.72,50.8 45.72,52.07 45.72,53.34 48.26,46.99 48.26,48.26 48.26,49.53 48.26,50.8 48.26,52.07 48.26,53.34 48.26,54.61 48.26,55.88 48.26,57.15 48.26,58.42 48.26,59.69 48.26,60.96 49.53,44.45 50.8,44.45 52.07,44.45 53.34,44.45 54.61,44.45 55.88,44.45 57.15,44.45 58.42,44.45 59.69,44.45 60.96,44.45 49.53,41.91 50.8,41.91 52.07,41.91 53.34,41.91 54.61,41.91 55.88,41.91 57.15,41.91 58.42,41.91 59.69,41.91 60.96,41.91 49.53,69.85 50.8,69.85 52.07,69.85 53.34,69.85 54.61,69.85 55.88,69.85 57.15,69.85 58.42,69.85 59.69,69.85 60.96,69.85 49.53,72.39 50.8,72.39 52.07,72.39 53.34,72.39 54.61,72.39 55.88,72.39 57.15,72.39 58.42,72.39 59.69,72.39 60.96,72.39 48.26,72.39 48.26,73.66 48.26,74.93 48.26,76.2 48.26,77.47 48.26,78.74 48.26,80.01 48.26,81.28 48.26,82.55 48.26,83.82 48.26,85.09 48.26,86.36 48.26,87.63 48.26,88.9 48.26,90.17 48.26,91.44 48.26,92.71 45.72,86.36 45.72,87.63 45.72,88.9 45.72,90.17 45.72,91.44 45.72,92.71 45.72,85.09 44.45,85.09 43.18,85.09 41.91,85.09 40.64,85.09 40.64,86.36 40.64,87.63 40.64,88.9 40.64,90.17 40.64,91.44 38.1,85.09 38.1,86.36 38.1,87.63 38.1,88.9 38.1,90.17 38.1,91.44 36.83,85.09 35.56,85.09 34.29,85.09 33.02,85.09 31.75,85.09 30.48,85.09 45.72,76.2 45.72,77.47 45.72,78.74 45.72,80.01 45.72,81.28 45.72,82.55 49.53,95.25 50.8,95.25 52.07,95.25 53.34,95.25 54.61,95.25 55.88,95.25 57.15,95.25 58.42,95.25 59.69,95.25 60.96,95.25 49.53,97.79 50.8,97.79 52.07,97.79 53.34,97.79 54.61,97.79 55.88,97.79 57.15,97.79 58.42,97.79 59.69,97.79 60.96,97.79 19.05,43.18 19.05,44.45 19.05,45.72 19.05,46.99 19.05,48.26 19.05,49.53 19.05,35.56 19.05,36.83 19.05,38.1 19.05,39.37 19.05,40.64 19.05,41.91 19.05,29.21 19.05,30.48 19.05,31.75 19.05,33.02 19.05,34.29 49.53,45.72 49.53,46.99 49.53,48.26 49.53,49.53 49.53,50.8 49.53,52.07 49.53,53.34 49.53,54.61 49.53,55.88 50.8,45.72 50.8,46.99 50.8,48.26 50.8,49.53 50.8,50.8 50.8,52.07 50.8,53.34 50.8,54.61 50.8,55.88 50.8,57.15 52.07,45.72 52.07,46.99 52.07,48.26 52.07,49.53 52.07,50.8 52.07,52.07 52.07,53.34 52.07,54.61 52.07,55.88 53.34,45.72 53.34,46.99 53.34,48.26 53.34,49.53 53.34,50.8 53.34,52.07 53.34,53.34 53.34,54.61 53.34,55.88 53.34,57.15 54.61,45.72 54.61,46.99 54.61,48.26 54.61,49.53 54.61,50.8 54.61,52.07 54.61,53.34 54.61,54.61 54.61,55.88 55.88,45.72 55.88,46.99 55.88,48.26 55.88,49.53 55.88,50.8 55.88,52.07 55.88,53.34 55.88,54.61 55.88,55.88 57.15,46.99 58.42,46.99 59.69,46.99 60.96,46.99 57.15,45.72 58.42,45.72 59.69,45.72 60.96,45.72 57.15,48.26 58.42,48.26 59.69,48.26 60.96,48.26 52.07,57.15 52.07,58.42 52.07,59.69 52.07,60.96 52.07,62.23 52.07,63.5 52.07,64.77 52.07,66.04 52.07,67.31 52.07,68.58 50.8,58.42 50.8,59.69 50.8,60.96 50.8,62.23 50.8,63.5 50.8,64.77 50.8,66.04 50.8,67.31 50.8,68.58 49.53,57.15 49.53,58.42 49.53,59.69 49.53,60.96 49.53,62.23 49.53,63.5 49.53,64.77 49.53,66.04 49.53,67.31 49.53,68.58 54.61,57.15 54.61,58.42 54.61,59.69 54.61,60.96 54.61,62.23 54.61,63.5 54.61,64.77 54.61,66.04 54.61,67.31 54.61,68.58 53.34,58.42 53.34,59.69 53.34,60.96 53.34,62.23 53.34,63.5 53.34,64.77 53.34,66.04 53.34,67.31 53.34,68.58 55.88,58.42 55.88,59.69 55.88,60.96 55.88,62.23 55.88,63.5 55.88,64.77 55.88,66.04 55.88,67.31 55.88,68.58 50.8,40.64 52.07,40.64 53.34,40.64 54.61,40.64 55.88,40.64 57.15,40.64 58.42,40.64 59.69,40.64 60.96,40.64 50.8,39.37 52.07,39.37 53.34,39.37 54.61,39.37 55.88,39.37 57.15,39.37 58.42,39.37 59.69,39.37 60.96,39.37 50.8,38.1 52.07,38.1 53.34,38.1 54.61,38.1 55.88,38.1 57.15,38.1 58.42,38.1 59.69,38.1 60.96,38.1 46.99,30.48 46.99,31.75 46.99,33.02 46.99,34.29 46.99,35.56 46.99,36.83 46.99,38.1 46.99,39.37 46.99,40.64 49.53,30.48 49.53,31.75 49.53,33.02 49.53,34.29 49.53,35.56 49.53,36.83 49.53,38.1 49.53,39.37 49.53,40.64 40.64,30.48 39.37,30.48 38.1,30.48 36.83,30.48 35.56,30.48 34.29,30.48 33.02,30.48 31.75,30.48 30.48,30.48 29.21,30.48 35.56,29.21 34.29,29.21 33.02,29.21 31.75,29.21 30.48,29.21 29.21,29.21 27.94,29.21 26.67,29.21 25.4,29.21 24.13,29.21 21.59,29.21 21.59,30.48 21.59,31.75 21.59,33.02 21.59,34.29 21.59,35.56 21.59,36.83 21.59,38.1 21.59,39.37 21.59,40.64 22.86,40.64 22.86,41.91 22.86,43.18 22.86,44.45 22.86,45.72 22.86,46.99 22.86,48.26 22.86,49.53 22.86,50.8 22.86,52.07 57.15,67.31 58.42,67.31 59.69,67.31 60.96,67.31 48.26,69.85 45.72,72.39 45.72,73.66 45.72,74.93 49.53,73.66 49.53,74.93 49.53,76.2 49.53,77.47 49.53,78.74 49.53,80.01 49.53,81.28 50.8,73.66 50.8,74.93 50.8,76.2 50.8,77.47 50.8,78.74 50.8,80.01 50.8,81.28 50.8,82.55 50.8,83.82 50.8,85.09 52.07,73.66 52.07,74.93 52.07,76.2 52.07,77.47 52.07,78.74 52.07,80.01 52.07,81.28 53.34,73.66 53.34,74.93 53.34,76.2 53.34,77.47 53.34,78.74 53.34,80.01 53.34,81.28 53.34,82.55 53.34,83.82 53.34,85.09 54.61,76.2 55.88,76.2 57.15,76.2 58.42,76.2 59.69,76.2 60.96,76.2 54.61,74.93 55.88,74.93 57.15,74.93 58.42,74.93 59.69,74.93 60.96,74.93 54.61,73.66 55.88,73.66 57.15,73.66 58.42,73.66 59.69,73.66 60.96,73.66 57.15,68.58 58.42,68.58 59.69,68.58 60.96,68.58 57.15,66.04 58.42,66.04 59.69,66.04 60.96,66.04 52.07,82.55 52.07,83.82 52.07,85.09 52.07,86.36 52.07,87.63 52.07,88.9 52.07,90.17 52.07,91.44 52.07,92.71 52.07,93.98 50.8,86.36 50.8,87.63 50.8,88.9 50.8,90.17 50.8,91.44 50.8,92.71 50.8,93.98 49.53,82.55 49.53,83.82 49.53,85.09 49.53,86.36 49.53,87.63 49.53,88.9 49.53,90.17 49.53,91.44 49.53,92.71 49.53,93.98 53.34,93.98 54.61,93.98 55.88,93.98 57.15,93.98 58.42,93.98 59.69,93.98 60.96,93.98 53.34,92.71 54.61,92.71 55.88,92.71 57.15,92.71 58.42,92.71 59.69,92.71 60.96,92.71 53.34,91.44 54.61,91.44 55.88,91.44 57.15,91.44 58.42,91.44 59.69,91.44 60.96,91.44 48.26,93.98 48.26,95.25 48.26,97.79 48.26,99.06 48.26,100.33 48.26,101.6 48.26,102.87 48.26,104.14 48.26,105.41 49.53,99.06 49.53,100.33 45.72,97.79 45.72,99.06 45.72,100.33 45.72,101.6 45.72,102.87 45.72,104.14 45.72,105.41 45.72,106.68 45.72,107.95 45.72,109.22 49.53,101.6 49.53,102.87 49.53,104.14 49.53,105.41 49.53,106.68 49.53,107.95 49.53,109.22 49.53,110.49 49.53,111.76 49.53,113.03 45.72,110.49 45.72,111.76 45.72,113.03 45.72,114.3 45.72,115.57 45.72,116.84 48.26,106.68 48.26,107.95 48.26,109.22 48.26,110.49 48.26,111.76 48.26,113.03 48.26,114.3 48.26,115.57 48.26,116.84 48.26,118.11 50.8,106.68 50.8,107.95 50.8,109.22 50.8,110.49 50.8,111.76 50.8,113.03 50.8,114.3 50.8,115.57 50.8,116.84 50.8,118.11 49.53,114.3 49.53,115.57 49.53,116.84 49.53,118.11 52.07,111.76 52.07,113.03 52.07,114.3 52.07,115.57 52.07,116.84 52.07,118.11 53.34,115.57 54.61,115.57 55.88,115.57 57.15,115.57 58.42,115.57 59.69,115.57 53.34,116.84 54.61,116.84 55.88,116.84 57.15,116.84 58.42,116.84 59.69,116.84 53.34,118.11 54.61,118.11 55.88,118.11 57.15,118.11 58.42,118.11 59.69,118.11 52.07,99.06 52.07,100.33 52.07,101.6 52.07,102.87 52.07,104.14 52.07,105.41 52.07,106.68 52.07,107.95 52.07,109.22 52.07,110.49 50.8,99.06 50.8,100.33 50.8,101.6 50.8,102.87 50.8,104.14 50.8,105.41 53.34,101.6 54.61,101.6 55.88,101.6 57.15,101.6 58.42,101.6 59.69,101.6 60.96,101.6 53.34,100.33 54.61,100.33 55.88,100.33 57.15,100.33 58.42,100.33 59.69,100.33 60.96,100.33 53.34,99.06 54.61,99.06 55.88,99.06 57.15,99.06 58.42,99.06 59.69,99.06 60.96,99.06 48.26,123.19 49.53,123.19 50.8,123.19 52.07,123.19 53.34,123.19 54.61,123.19 55.88,123.19 57.15,123.19 58.42,123.19 59.69,123.19 48.26,124.46 49.53,124.46 50.8,124.46 52.07,124.46 53.34,124.46 54.61,124.46 55.88,124.46 57.15,124.46 58.42,124.46 59.69,124.46 48.26,125.73 49.53,125.73 50.8,125.73 52.07,125.73 53.34,125.73 54.61,125.73 55.88,125.73 57.15,125.73 58.42,125.73 59.69,125.73 48.26,127 49.53,127 50.8,127 52.07,127 53.34,127 54.61,127 55.88,127 57.15,127 58.42,127 59.69,127 48.26,128.27 49.53,128.27 50.8,128.27 52.07,128.27 53.34,128.27 54.61,128.27 55.88,128.27 57.15,128.27 58.42,128.27 59.69,128.27 17.78,44.45 17.78,45.72 17.78,46.99 17.78,48.26 17.78,49.53 17.78,50.8 17.78,36.83 17.78,38.1 17.78,39.37 17.78,40.64 17.78,41.91 17.78,43.18 17.78,31.75 17.78,33.02 17.78,34.29 17.78,35.56 16.51,45.72 16.51,46.99 16.51,48.26 16.51,49.53 16.51,50.8 16.51,52.07 16.51,38.1 16.51,39.37 16.51,40.64 16.51,41.91 16.51,43.18 16.51,44.45 16.51,33.02 16.51,34.29 16.51,35.56 16.51,36.83 15.24,46.99 15.24,48.26 15.24,49.53 15.24,50.8 15.24,52.07 15.24,53.34 15.24,39.37 15.24,40.64 15.24,41.91 15.24,43.18 15.24,44.45 15.24,45.72 15.24,34.29 15.24,35.56 15.24,36.83 15.24,38.1 13.97,46.99 13.97,48.26 13.97,49.53 13.97,50.8 13.97,52.07 13.97,53.34 13.97,39.37 13.97,40.64 13.97,41.91 13.97,43.18 13.97,44.45 13.97,45.72 13.97,34.29 13.97,35.56 13.97,36.83 13.97,38.1
  pour Top: 0,0 0,165.1 76.2,165.1 76.2,0
  pour Bottom: 0,0 0,165.1 76.2,165.1 76.2,0
N$1  (via drill 1.78)
  other vias: 68.58,125.73
N$2  (via drill 1.78)
  other vias: 68.58,115.57
N$3  (via drill 1.78)
  other vias: 7.62,87.63
N$4  (via drill 1.78)
  other vias: 7.62,77.47
N$5  (via drill 1.78)
  other vias: 68.58,101.6
N$6  (via drill 1.78)
  other vias: 68.58,91.44
N$9  (via drill 1.78)
  other vias: 68.58,76.2
N$10  (via drill 1.78)
  other vias: 68.58,66.04
N$13  (via drill 1.78)
  other vias: 68.58,48.26
N$14  (via drill 1.78)
  other vias: 68.58,38.1
SWITCH  (via drill 0.35)
  Top 0.508: 19.05,88.9 J1.S 19.05,76.2 19.05,60.96 22.86,57.15 v35.56,57.15 | v41.91,132.08 44.45,129.54 44.45,123.19 IC2.12 | 19.05,88.9 19.05,107.95 | 19.05,107.95 v35.56,107.95 | v43.18,107.95 44.45,106.68 44.45,99.06 IC1.12 | v43.18,57.15 43.18,45.72 IC4.12 | 19.05,88.9 20.32,88.9 25.4,83.82 v34.29,83.82 | v44.45,83.82 44.45,73.66 IC3.12 | v34.29,132.08 22.86,132.08 19.05,128.27 19.05,107.95
  Bottom 0.508: v34.29,132.08 v41.91,132.08 | v35.56,107.95 v43.18,107.95 | v35.56,57.15 v43.18,57.15 | v34.29,83.82 v44.45,83.82
VDD  (via drill 0.35)
  Top 0.508: C5.+ 7.66,142.24 12.7,142.24 | J4.1 22.86,146.05 19.03,142.22 | 12.7,142.24 12.7,132.08 | 12.7,132.08 12.7,109.22 | 12.7,109.22 12.7,101.6 2.54,91.44 2.54,77.47 8.89,71.12 v13.97,71.12 13.97,55.88 15.24,54.61 16.51,54.61 | 16.51,54.61 v33.02,54.61 | v41.91,50.8 41.91,49.59 IC4.14 | IC3.14 40.58,78.67 v41.91,80.01 | IC1.14 41.91,102.94 v41.91,105.41 | v15.24,109.22 12.7,109.22 | IC2.14 40.64,125.8 v40.64,128.27 | v15.24,132.08 12.7,132.08 | 16.51,54.61 20.32,50.8 C2.+ | C1.+ C2.+ | J3.1 22.86,17.78 24.13,19.05 24.13,21.55 C2.+ | 12.7,142.24 19.01,142.24 19.03,142.22 | 19.03,142.22 C6.+
  Bottom 0.508: v33.02,54.61 38.1,54.61 v41.91,50.8 | v41.91,80.01 35.56,80.01 33.02,82.55 25.4,82.55 v13.97,71.12 | v41.91,105.41 35.56,105.41 31.75,109.22 v15.24,109.22 | v40.64,128.27 36.83,128.27 35.56,129.54 34.29,129.54 31.75,132.08 v15.24,132.08
VOUT
  Top 0.508: J2.S IC2.10
VOUT2
  Top 0.508: J20.S IC1.10
VOUT3
  Top 0.508: J30.S IC3.10
VOUT4
  Top 0.508: J40.S IC4.10
VSS  (via drill 0.35)
  Top 0.508: IC2.9 v44.45,119.38 46.99,116.84 v46.99,99.06 | v46.99,124.46 46.99,128.31 C8.- | C8.- C7.- | C8.- 43.18,149.9 J6.1 | v46.99,73.66 v46.99,95.25 IC1.9 | IC3.9 v46.99,69.85 v46.99,45.72 | IC4.9 v46.99,41.91 48.26,40.64 48.26,22.9 C4.- | C4.- C3.- | J9.1 43.18,17.82 C4.-
  Bottom 0.508: v44.45,119.38 44.45,121.92 v46.99,124.46 | v46.99,99.06 v46.99,95.25 | v46.99,73.66 v46.99,69.85 | v46.99,45.72 v46.99,41.91

### Text on the board
tValues: VDD | GND | VSS | 5V | Channel 1 Out | Channel 2 Out | Channel 3 Out | Switch Input | Channel 4 Out | Alex Sludds (asludds@mit.edu) | MIT Quantum Photonics Group | Four Channel Switched Integrator | VDD | GND | VSS | 5V